# Altium schematic sheet Eth_to_SPI.SchDoc (part 1 of 3)
size A4; PageSetup: Record=PageOptions|CenterHorizontal=True|CenterVertical=True|PrintScale=0.97|XCorrection=1.00|YCorrection=1.00|PrintKind=1|BorderSize=5000000|LeftOffset=0|BottomOffset=0|Orientation=2|PaperLength=1000|PaperWidth=1000|Scale=100|PaperSource=7|PrintQuality=-3|MediaType=1|DitherType=10|PrintScaleMode=1|PaperKind=A4|PaperIndex=9
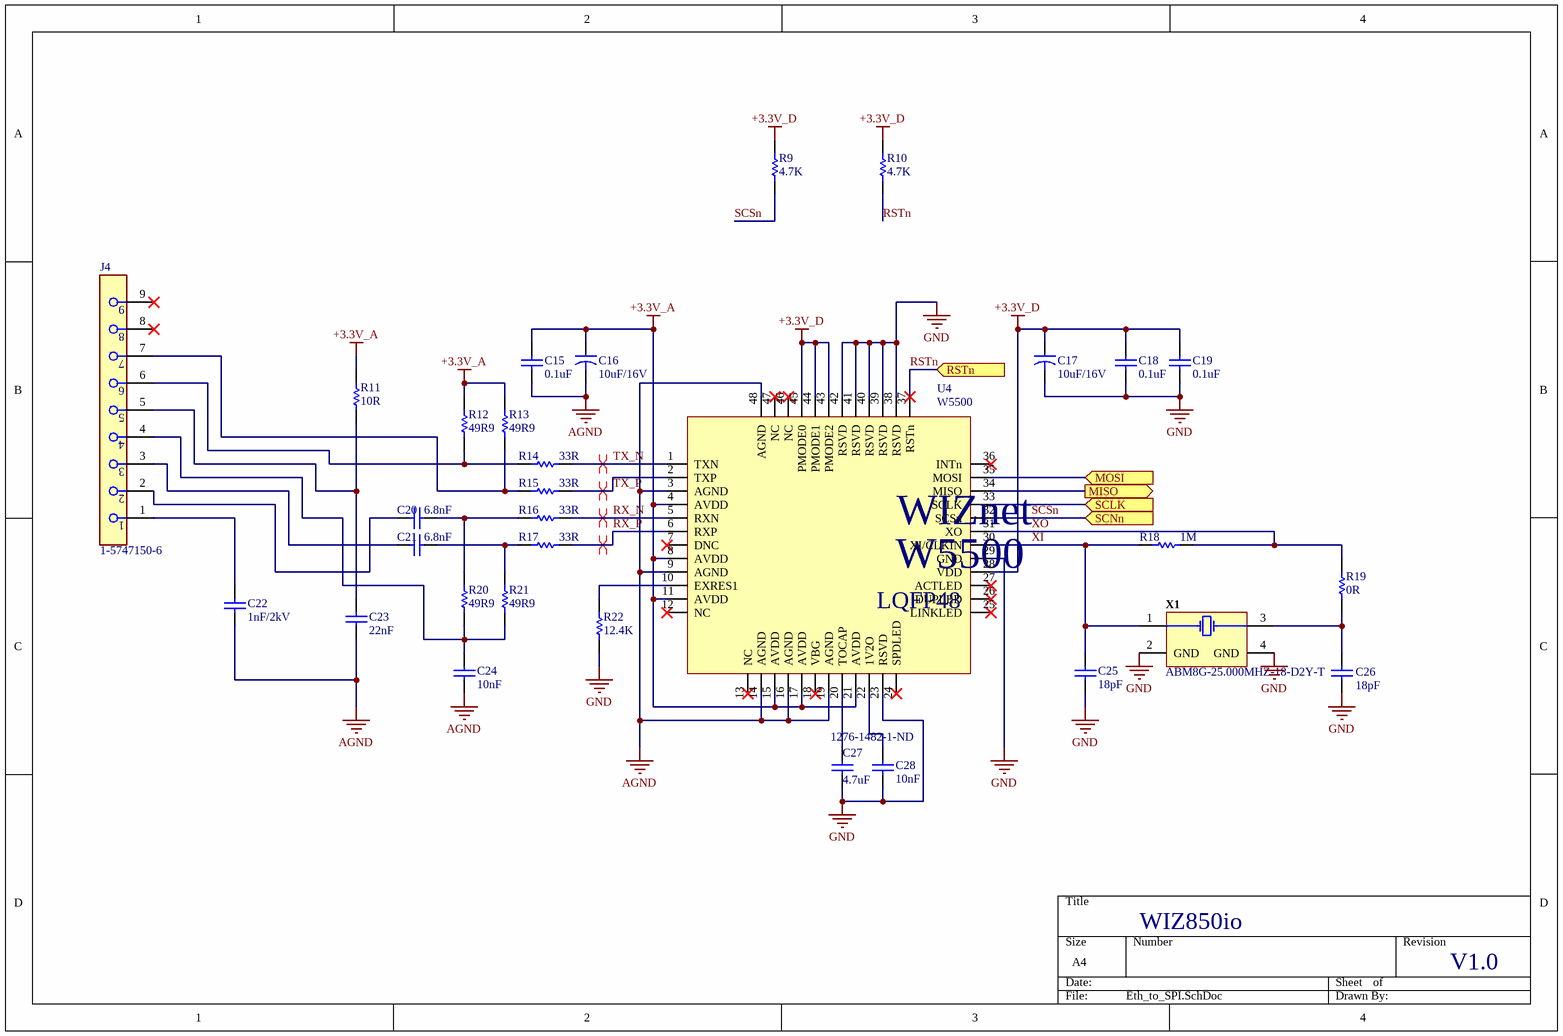
[diagram p0: Eth_to_SPI.SchDoc]

## Parts
C15  0.1uF  [J1-0603]
C16  10uF/16V  [10uF 16V]
C17  10uF/16V  [10uF 16V]
C18  0.1uF  [J1-0603]
C19  0.1uF  [J1-0603]
C20  6.8nF  [6.8nF]
C21  6.8nF  [6.8nF]
C22  1nF/2kV  [1nF/2kV]
C23  22nF  [22nF]
C24  10nF  [10nF]
C25  18pF  [18pF]
C26  18pF  [18pF]
C27  4.7uF  Supplier Part Number 1: 1276-1482-1-ND  [4.7 uF]
C28  10nF  [10nF]
J4  1-5747150-6  [FP-1-5747150-6-MFG]
R9  4.7K  [4.7k OHM R]
R10  4.7K  [4.7k OHM R]
R11  10R  [10OHM R]
R12  49R9  [49R9 OHM]
R13  49R9  [49R9 OHM]
R14  33R  [33OHM R]
R15  33R  [33OHM R]
R16  33R  [33OHM R]
R17  33R  [33OHM R]
R18  1M  [1M OHM R]
R19  0R  [0 OHM R]
R20  49R9  [49R9 OHM]
R21  49R9  [49R9 OHM]
R22  12.4K  [12.4k OHM R]
U4  W5500  [QFP50P900X900X160-48N]
X1  ABM8G-25.000MHZ-18-D2Y-T  [ABRA-ABM8G_V]

## Ports
MISO (out), MOSI (in), RSTn (in), SCLK (in), SCNn (in)

## Nets
+3.3V_A: C15.2 C16.1 R11.2 R12.2 R13.2 U4.4(AVDD) U4.8(AVDD) U4.11(AVDD) U4.15(AVDD) U4.17(AVDD) U4.21(AVDD)
+3.3V_D: C17.1 C18.2 C19.2 R9.2 R10.2 U4.28(VDD) U4.43(PMODE2) U4.44(PMODE1) U4.45(PMODE0)
AGND: C15.1 C16.2 C22.2 C23.1 C24.1 U4.3(AGND) U4.9(AGND) U4.14(AGND) U4.16(AGND) U4.19(AGND) U4.48(AGND)
GND: C17.2 C18.1 C19.1 C25.1 C26.1 C27.1 C28.1 R22.1 U4.23(RSVD) U4.29(GND) U4.38(RSVD) U4.39(RSVD) U4.40(RSVD) U4.41(RSVD) U4.42(RSVD) X1.2(GND) X1.4(GND)
MISO: U4.34(MISO) ; port MISO
MOSI: U4.35(MOSI) ; port MOSI
RSTn: R10.1 U4.37(RSTn) ; port RSTn
RX_N: R16.2 U4.5(RXN)
RX_P: R17.2 U4.6(RXP)
SCLK: U4.33(SCLK) ; port SCLK
SCSn: R9.1 U4.32(SCSn) ; port SCNn
TX_N: R14.2 U4.1(TXN)
TX_P: R15.2 U4.2(TXP)
XI: C25.2 R18.1 U4.30(XI/CLKIN) X1.1(X1)
XO: R18.2 R19.2 U4.31(XO)
NetC20_1: C20.1 J4.2
NetC20_2: C20.2 R16.1 R20.2
NetC21_1: C21.1 J4.3
NetC21_2: C21.2 R17.1 R21.2
NetC22_1: C22.1 J4.1
NetC23_2: C23.2 J4.5 R11.1
NetC24_2: C24.2 J4.4 R20.1 R21.1
NetC26_2: C26.2 R19.1 X1.3(X2)
NetC27_2: C27.2 U4.20(TOCAP)
NetC28_2: C28.2 U4.22(1V2O)
NetJ4_6: J4.6 R12.1 R14.1
NetJ4_7: J4.7 R13.1 R15.1
NetR22_2: R22.2 U4.10(EXRES1)

Not connected (* = marked no-connect by the designer): J4 8* 9*; U4 7(DNC)* 12(NC)* 13(NC)* 18(VBG)* 24(SPDLED)* 25(LINKLED)* 26(DUPLED)* 27(ACTLED)* 36(INTn)* 46(NC)* 47(NC)*

## Layout directives
differential pair: RX_N, RX_P, TX_N, TX_P

## Notes on the sheet
- WIZ850io
- V1.0
- (in symbol W5500) LQFP48